# EAGLE schematic ESP32-C3_v1.0_Schematic (EAGLE 9.7.0)
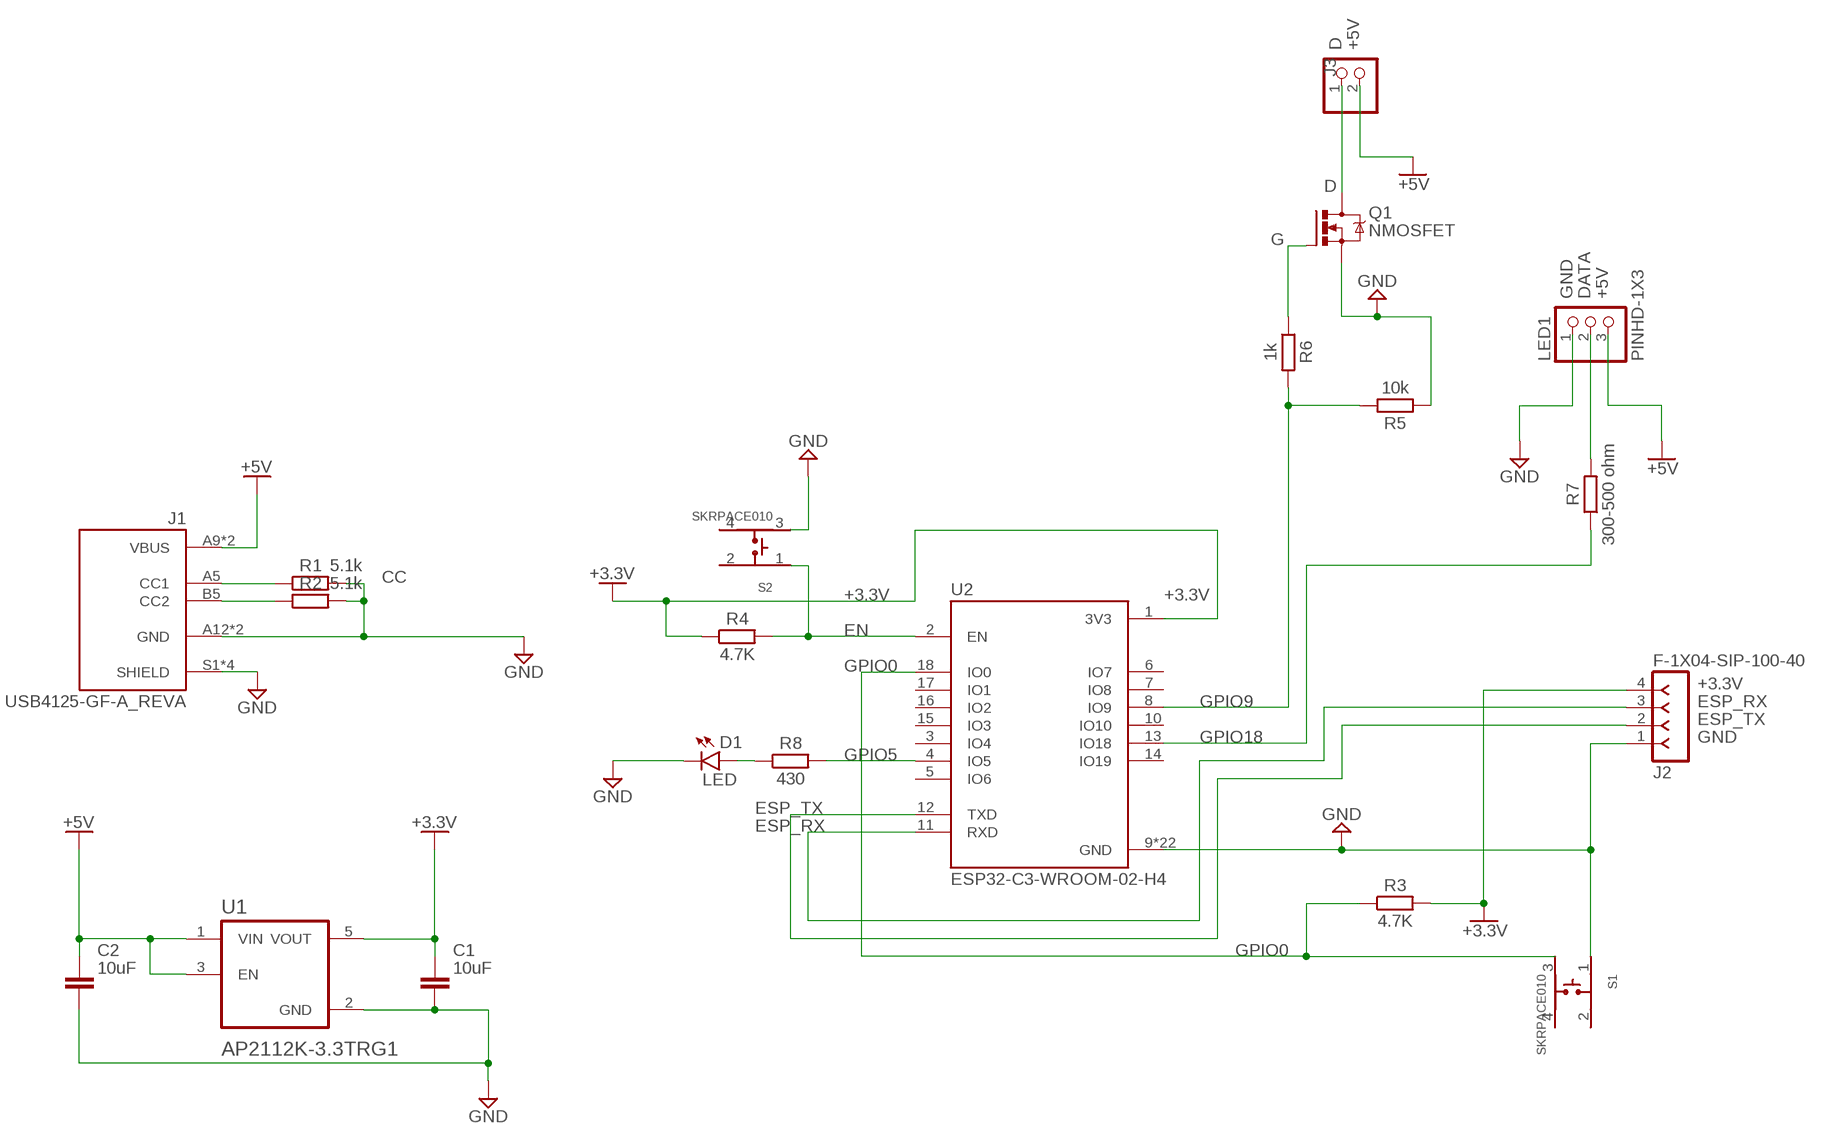
[diagram p0: schematic, sheet 1]

## Parts
C1  10uF  C_CHIP-0603(1608-METRIC)  [CAPC1608X85]
C2  10uF  C_CHIP-0603(1608-METRIC)  [CAPC1608X85]
D1  LED  CHIP-FLAT-R_0603-0.80MM  [LEDC1608X80N_FLAT-R]
J1  USB4125-GF-A_REVA  [GCT_USB4125-GF-A_REVA]
J2  F-1X04-SIP-100-40  [SIP-100-04-40]
J3  PINHD-1X2  [1X02]
LED1  PINHD-1X3  [1X03]
Q1  NMOSFET  NMOSFET_SOT23-GSD  [SOT23]
R1  5.1k  R_CHIP-0603(1608-METRIC)  [RESC1608X60]
R2  5.1k  R_CHIP-0603(1608-METRIC)  [RESC1608X60]
R3  4.7K  R_CHIP-0603(1608-METRIC)  [RESC1608X60]
R4  4.7K  R_CHIP-0603(1608-METRIC)  [RESC1608X60]
R5  10k  R_CHIP-0603(1608-METRIC)  [RESC1608X60]
R6  1k  R_CHIP-0603(1608-METRIC)  [RESC1608X60]
R7  300-500 ohm  R_CHIP-0603(1608-METRIC)  [RESC1608X60]
R8  430  R_CHIP-0603(1608-METRIC)  [RESC1608X60]
S1  SKRPACE010  [SW_SKRPACE010]
S2  SKRPACE010  [SW_SKRPACE010]
U1  AP2112K-3.3TRG1  [SOT95P285X140-5N]
U2  ESP32-C3-WROOM-02-H4  [MODULE_ESP32-C3-WROOM-02-H4]

## Nets
+3.3V [5V]: C1.1 J2.4 R3.2 R4.1 U1.5(VOUT) U2.1(3V3)
+5V [5V]: C2.1 J1.A9(VBUS) J1.B9(VBUS) J3.2 LED1.3 U1.1(VIN) U1.3(EN)
CC: J1.A5(CC1) R1.1
D [GND]: J3.1 Q1.3(D)
DATA: LED1.2 R7.2
EN: R4.2 S2.1 U2.2(EN)
ESP_RX: J2.3 U2.11(RXD)
ESP_TX: J2.2 U2.12(TXD)
G: Q1.1(G) R6.1
GND [GND]: C1.2 C2.2 D1.C J1.A12(GND) J1.B12(GND) J1.S1(SHIELD) J1.S2(SHIELD) J1.S3(SHIELD) J1.S4(SHIELD) J2.1 LED1.1 Q1.2(S) R1.2 R2.2 R5.1 S1.1 S2.3 U1.2(GND) U2.9(GND) U2.19(GND) U2.20(GND) U2.21(GND) U2.22(GND) U2.23(GND) U2.24(GND) U2.25(GND) U2.26(GND) U2.27(GND) U2.28(GND) U2.29(GND) U2.30(GND) U2.31(GND) U2.32(GND) U2.33(GND) U2.34(GND) U2.35(GND) U2.36(GND) U2.37(GND) U2.38(GND) U2.39(GND)
GPIO0: R3.1 S1.3 U2.18(IO0)
GPIO5: R8.2 U2.4(IO5)
GPIO9: R5.2 R6.2 U2.8(IO9)
GPIO18: R7.1 U2.13(IO18)
LED: D1.A R8.1
N$1: J1.B5(CC2) R2.1
Unconnected: S1.2 S1.4 S2.2 S2.4 U2.3(IO4) U2.5(IO6) U2.6(IO7) U2.7(IO8) U2.10(IO10) U2.14(IO19) U2.15(IO3) U2.16(IO2) U2.17(IO1)

## Library data of the parts
C1 C2 = Capacitor:C: Capacitor - Generic; CATEGORY: Capacitor
D1 = LED:CHIP-FLAT-R; CATEGORY: LED; COLOR: RED; DESCRIPTION: CHIP LED FLAT; SUB-CATEGORY: CHIP; TYPE: FLAT_TOP; VALUE: LED_RED
J1 = USB4125-GF-A_REVA model:USB4125-GF-A_REVA: USB 2.0 Type C Receptacle, Horizontal, SMT, For Power charging Check prices <https://pricing.snapeda.com/parts/USB4125-GF-A/Global%20Connector%20Technology/view-part?ref=eda>; AVAILABILITY: Warning; DESCRIPTION: USB Charge Only Connector Type C Horizontal Receptacle, 3.16mm profile, 6 Pins, Surface mount, Top mount, low cost; MF: Global Connector Technology; MP: USB4125-GF-A; PACKAGE: None; PRICE: None; PURCHASE-URL: https://pricing.snapeda.com/search/part/USB4125-GF-A/?ref=eda
J2 = con-headers-jp:F-1X04-: FEMALE HEADER
J3 = Connector:PINHD-1X2: PIN HEADER; CATEGORY: CONNECTOR; SUB-CATEGORY: PIN-HEADER
LED1 = Connector:PINHD-1X3: PIN HEADER; CATEGORY: CONNECTOR; SUB-CATEGORY: PIN-HEADER
Q1 = Transistor:NMOSFET: N-Channel MOSFET - Generic; CATEGORY: Transistor; SUB-CATEGORY: MOSFET; TYPE: N-Channel
R1-R8 = Resistor:R: Resistor Fixed - Generic; CATEGORY: Resistor; SUB-CATEGORY: Fixed
S1 S2 = SKRPACE010:SKRPACE010: Switch Tactile N.O. SPST Button J-Bend 0.05A 16VDC 2.55N SMD Automotive T/R; MANUFACTURER: ALPS; STANDARD: Maniufacturer Recommendations
U1 = AP2112K-3.3TRG1:AP2112K-3.3TRG1: AP2112 Series 0.6 A 3.3 V Fixed Output SMT LDO Linear Regulator - SOT23-5; MANUFACTURER: Diodes Inc.; PARTREV: 2-2
U2 = ESP32-C3-WROOM-02-H4:ESP32-C3-WROOM-02-H4: WiFi Modules (802.11) (Engineering Samples) SMD module, ESP32-C3, 4MB SPI flash, PCB antenna, -40 C +105 C Check availability <https://pricing.snapeda.com/parts/ESP32-C3-WROOM-02-H4/Espressif%20Systems/view-part?ref=eda>; AVAILABILITY: In Stock; DESCRIPTION: WiFi Modules (802.11) (Engineering Samples) SMD module, ESP32-C3, 4MB SPI flash, PCB antenna, -40 C +105 C; MF: Espressif Systems; MP: ESP32-C3-WROOM-02-H4; PACKAGE: None; PRICE: None; PURCHASE-URL: https://pricing.snapeda.com/search/part/ESP32-C3-WROOM-02-H4/?ref=eda

## Net classes
0 default: width 0.254 mm
1 5V: width 0.635 mm
2 GND: width 0.635 mm